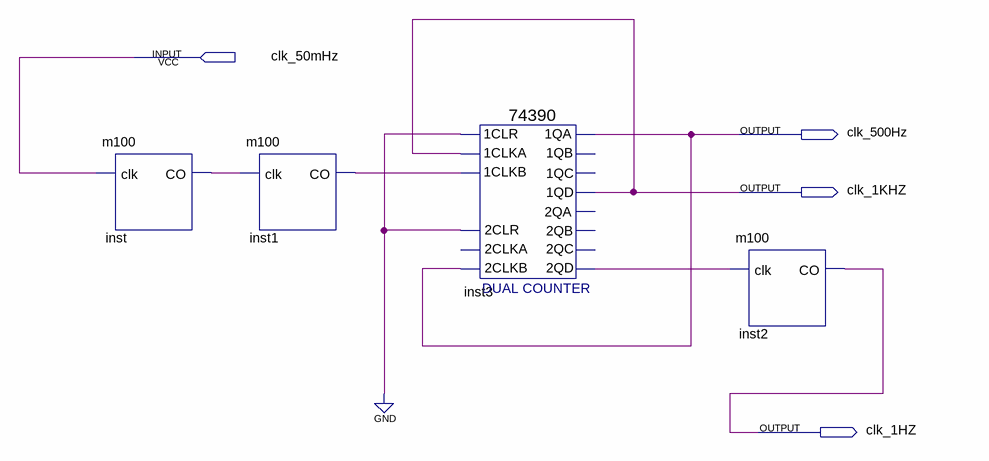
[diagram p0: schematic sheet]
// Quartus schematic fre_div.bdf as structural Verilog: 4 symbols, 4 pins
module fre_div (
  input  clk_50mHz,
  output clk_500Hz,
  output clk_1KHZ,
  output clk_1HZ
);

  wire inst1_co, inst3_2qd, inst_co;

  m100 inst (.clk(clk_50mHz), .CO(inst_co));
  m100 inst1 (.clk(inst_co), .CO(inst1_co));
  \74390  inst3 (
    .\2CLR (1'b0), .\2CLKB (clk_500Hz), .\1CLR (1'b0), .\1CLKA (clk_1KHZ), .\1CLKB (inst1_co),
    .\1QA (clk_500Hz), .\1QD (clk_1KHZ), .\2QD (inst3_2qd));  // open: 2CLKA, 1QB, 1QC, 2QA, 2QB, 2QC
  m100 inst2 (.clk(inst3_2qd), .CO(clk_1HZ));
endmodule
